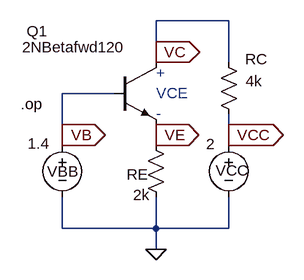
[diagram p0: schematic prob5_20c.asc]
prob5_20c.asc, the LTspice schematic file:
Version 4
SHEET 1 880 680
WIRE 320 64 208 64
WIRE 208 112 208 64
WIRE 208 128 208 112
WIRE 320 128 320 64
WIRE 144 176 64 176
WIRE 64 240 64 176
WIRE 208 240 208 224
WIRE 320 240 320 208
WIRE 64 256 64 240
WIRE 208 256 208 240
WIRE 320 256 320 240
WIRE 64 384 64 336
WIRE 208 384 208 336
WIRE 208 384 64 384
WIRE 320 384 320 336
WIRE 320 384 208 384
WIRE 208 416 208 384
FLAG 208 416 0
FLAG 208 112 VC
IOPIN 208 112 Out
FLAG 208 240 VE
IOPIN 208 240 Out
FLAG 64 240 VB
IOPIN 64 240 Out
FLAG 320 240 VCC
IOPIN 320 240 Out
SYMBOL npn 144 128 R0
WINDOW 0 -135 -48 Left 2
WINDOW 3 -142 -23 Left 2
SYMATTR InstName Q1
SYMATTR Value 2NBetafwd120
SYMBOL voltage 64 240 R0
WINDOW 0 -23 56 Left 2
WINDOW 3 -53 13 Left 2
SYMATTR InstName VBB
SYMATTR Value 1.4
SYMBOL voltage 320 240 R0
WINDOW 0 -20 55 Left 2
WINDOW 3 -35 14 Left 2
SYMATTR InstName VCC
SYMATTR Value 2
SYMBOL res 304 112 R0
WINDOW 0 41 11 Left 2
WINDOW 3 42 45 Left 2
SYMATTR InstName RC
SYMATTR Value 4k
SYMBOL res 192 240 R0
WINDOW 0 -29 61 Left 2
WINDOW 3 -19 92 Left 2
SYMATTR InstName RE
SYMATTR Value 2k
TEXT 0 192 Left 2 !.op
TEXT 208 144 Left 2 ;+\nVCE\n-

The netlist it stands for:
* prob5_20c.asc
Q1 VC VB VE 0 2NBetafwd120
VBB VB 0 1.4
VCC VCC 0 2
RC VC VCC 4k
RE VE 0 2k
.model NPN NPN
.model PNP PNP
.lib standard.bjt
.op
* +
* VCE
* -
.backanno
.end

* Results of the author's LTspice run, read from the files saved beside the schematic
* Operating Point:
*   V(vc) = 784.5 mV
*   V(vb) = 1.4 V
*   V(ve) = 757.8 mV
*   V(vcc) = 2 V
*   Ic(Q1) = 303.9 µA
*   Ib(Q1) = 75.04 µA
*   Ie(Q1) = -378.9 µA
*   I(Rc) = -303.9 µA
*   I(Re) = 378.9 µA
*   I(Vbb) = -75.04 µA
*   I(Vcc) = -303.9 µA